# Altium schematic sheet jetson-nano.SchDoc
size A3; SheetNumber: 2; SheetTotal: 5
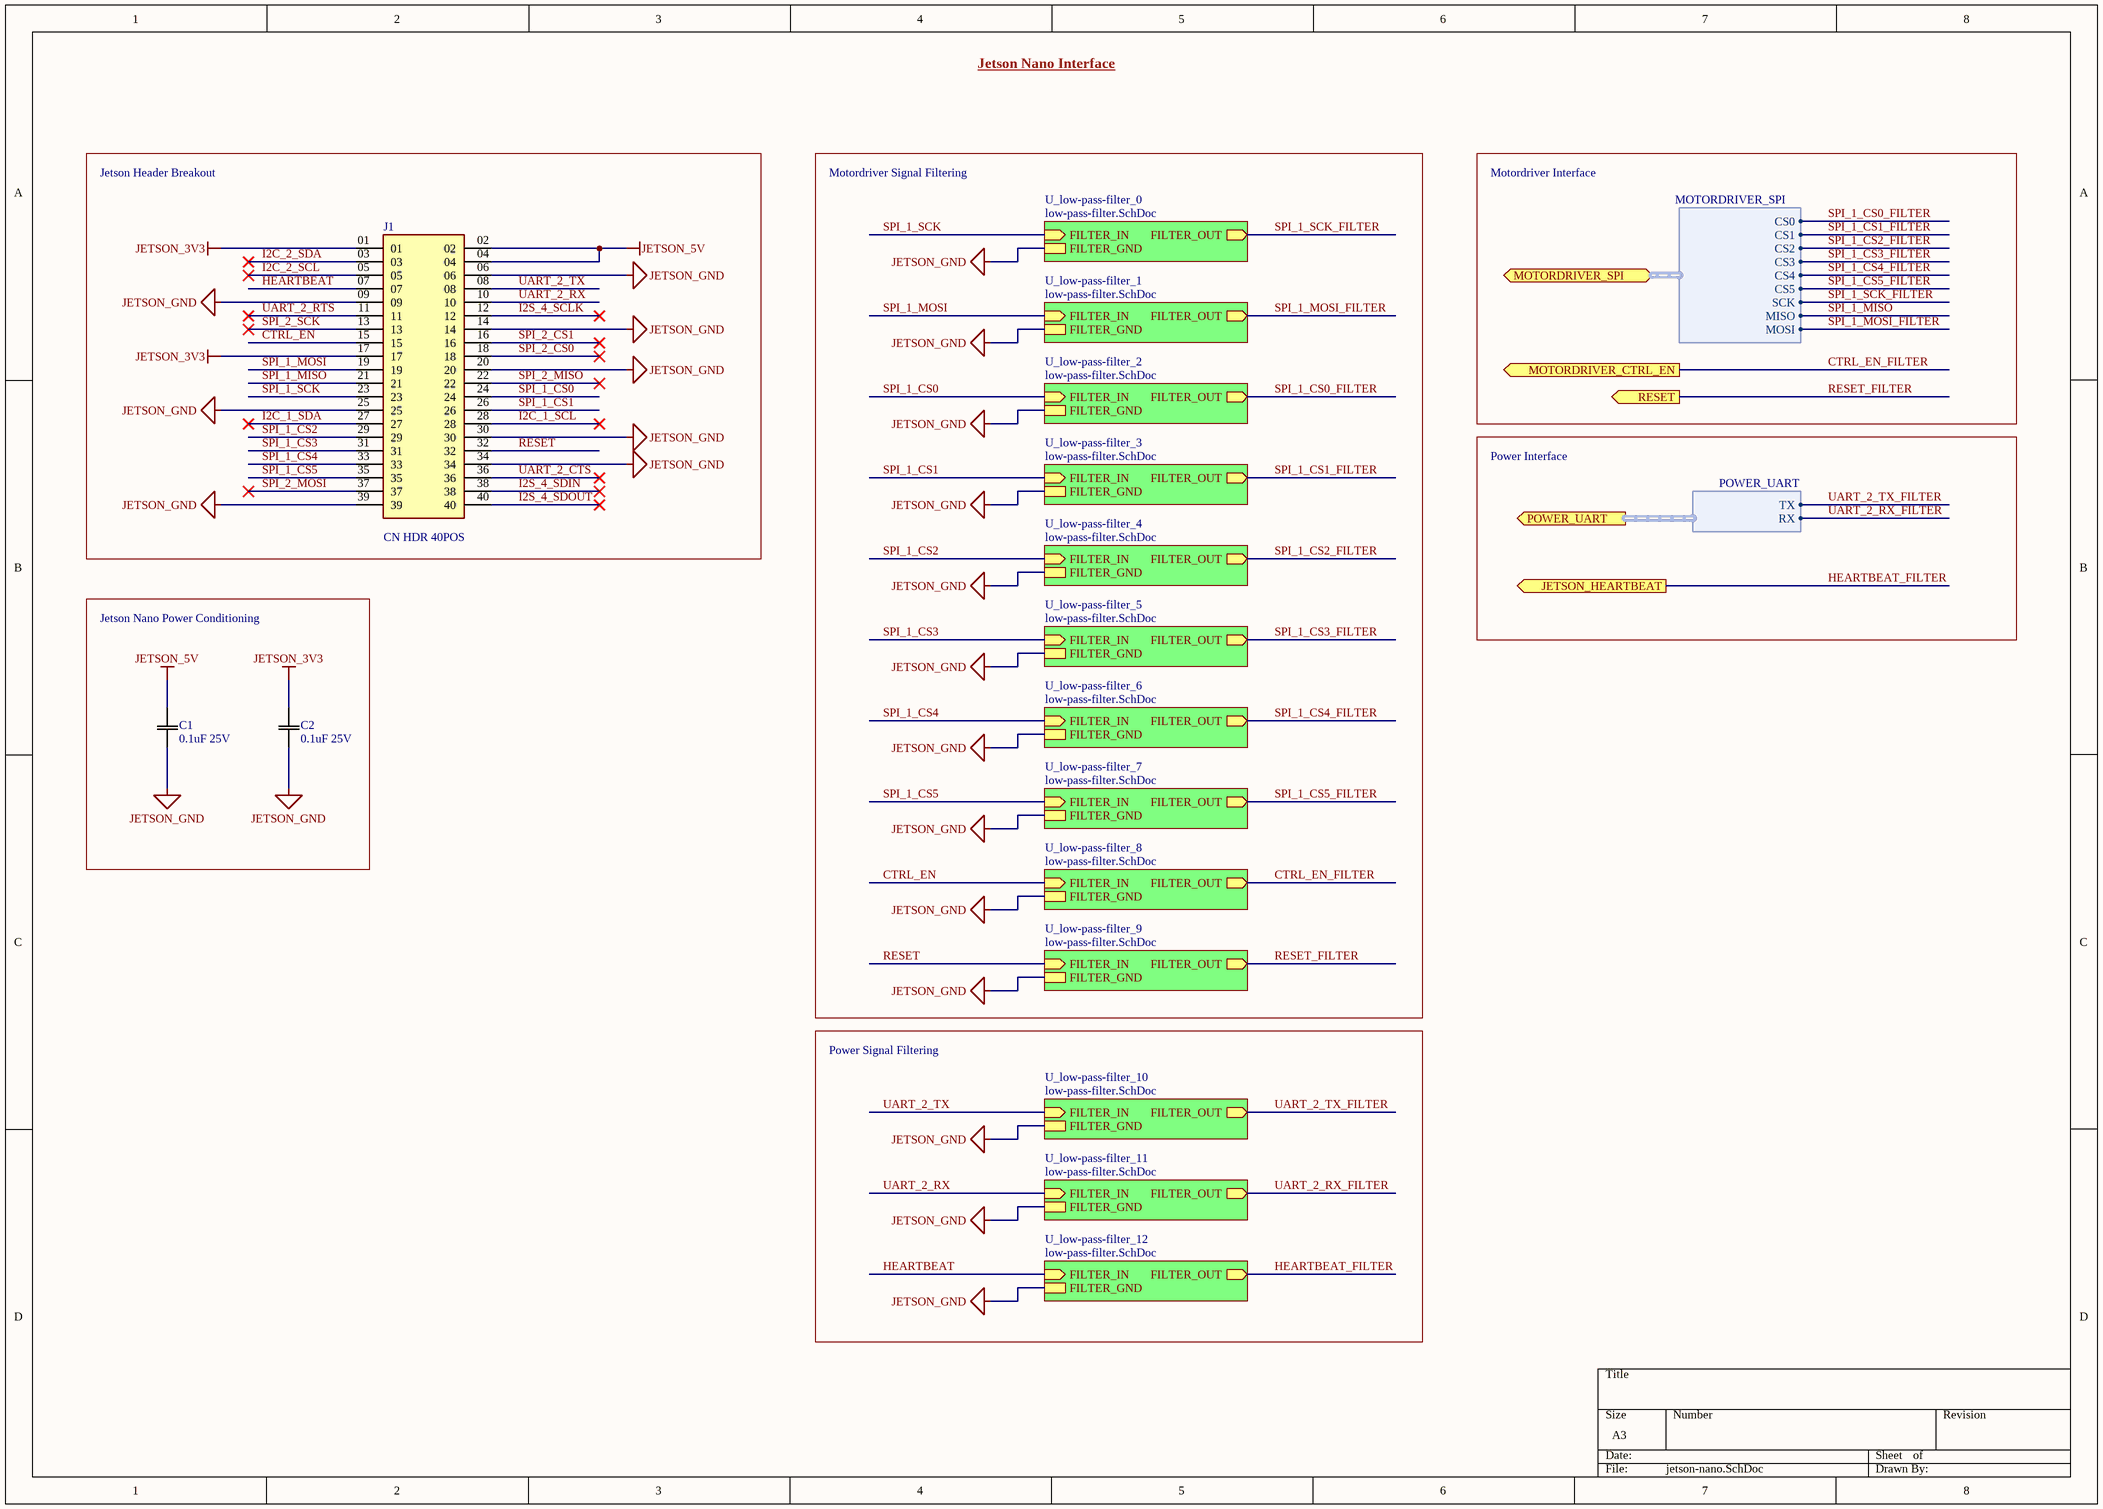
[diagram p0: jetson-nano.SchDoc]

## Parts
C1  0.1uF 25V  [0805]
C2  0.1uF 25V  [0805]
J1  CN HDR 40POS  [CN HDR 40POS 0.1 TH]

## Blocks framed on the sheet
Jetson Header Breakout: J1
Jetson Nano Power Conditioning: C1 C2

## Sub-sheets
U_low-pass-filter_0 = low-pass-filter.SchDoc: FILTER_OUT (out), FILTER_IN (in), FILTER_GND
U_low-pass-filter_1 = low-pass-filter.SchDoc: FILTER_OUT (out), FILTER_IN (in), FILTER_GND
U_low-pass-filter_2 = low-pass-filter.SchDoc: FILTER_OUT (out), FILTER_IN (in), FILTER_GND
U_low-pass-filter_3 = low-pass-filter.SchDoc: FILTER_OUT (out), FILTER_IN (in), FILTER_GND
U_low-pass-filter_4 = low-pass-filter.SchDoc: FILTER_OUT (out), FILTER_IN (in), FILTER_GND
U_low-pass-filter_5 = low-pass-filter.SchDoc: FILTER_OUT (out), FILTER_IN (in), FILTER_GND
U_low-pass-filter_6 = low-pass-filter.SchDoc: FILTER_OUT (out), FILTER_IN (in), FILTER_GND
U_low-pass-filter_7 = low-pass-filter.SchDoc: FILTER_OUT (out), FILTER_IN (in), FILTER_GND
U_low-pass-filter_8 = low-pass-filter.SchDoc: FILTER_OUT (out), FILTER_IN (in), FILTER_GND
U_low-pass-filter_9 = low-pass-filter.SchDoc: FILTER_OUT (out), FILTER_IN (in), FILTER_GND
U_low-pass-filter_10 = low-pass-filter.SchDoc: FILTER_OUT (out), FILTER_IN (in), FILTER_GND
U_low-pass-filter_11 = low-pass-filter.SchDoc: FILTER_OUT (out), FILTER_IN (in), FILTER_GND
U_low-pass-filter_12 = low-pass-filter.SchDoc: FILTER_OUT (out), FILTER_IN (in), FILTER_GND

## Ports
JETSON_HEARTBEAT (out), MOTORDRIVER_CTRL_EN (out), MOTORDRIVER_SPI (bidir, harness MOTORDRIVER_SPI), POWER_UART (out, harness POWER_UART), RESET (out)

## Harnesses
POWER_UART: TX, RX
MOTORDRIVER_SPI: CS0, CS1, CS2, CS3, CS4, CS5, SCK, MISO, MOSI

## Nets
JETSON_3V3: C2.2(C2) J1.01 J1.17
JETSON_5V: C1.2(C2) J1.02 J1.04
JETSON_GND: C1.1(C1) C2.1(C1) J1.06 J1.09 J1.14 J1.20 J1.25 J1.30 J1.34 J1.39 ; sheet U_low-pass-filter_7/FILTER_GND, sheet U_low-pass-filter_0/FILTER_GND, sheet U_low-pass-filter_1/FILTER_GND, sheet U_low-pass-filter_2/FILTER_GND, sheet U_low-pass-filter_3/FILTER_GND, sheet U_low-pass-filter_4/FILTER_GND, sheet U_low-pass-filter_5/FILTER_GND, sheet U_low-pass-filter_6/FILTER_GND, sheet U_low-pass-filter_10/FILTER_GND, sheet U_low-pass-filter_11/FILTER_GND, sheet U_low-pass-filter_12/FILTER_GND, sheet U_low-pass-filter_8/FILTER_GND, sheet U_low-pass-filter_9/FILTER_GND
CTRL_EN: J1.15 ; sheet U_low-pass-filter_8/FILTER_IN
CTRL_EN_FILTER: port MOTORDRIVER_CTRL_EN, sheet U_low-pass-filter_8/FILTER_OUT
HEARTBEAT: J1.07 ; sheet U_low-pass-filter_12/FILTER_IN
HEARTBEAT_FILTER: port JETSON_HEARTBEAT, sheet U_low-pass-filter_12/FILTER_OUT
I2C_1_SCL: J1.28
I2C_1_SDA: J1.27
I2C_2_SCL: J1.05
I2C_2_SDA: J1.03
I2S_4_SCLK: J1.12
I2S_4_SDIN: J1.38
I2S_4_SDOUT: J1.40
RESET: J1.32 ; sheet U_low-pass-filter_9/FILTER_IN
RESET_FILTER: port RESET, sheet U_low-pass-filter_9/FILTER_OUT
SPI_1_CS0: J1.24 ; sheet U_low-pass-filter_2/FILTER_IN
SPI_1_CS0_FILTER: sheet U_low-pass-filter_2/FILTER_OUT, port MOTORDRIVER_SPI.CS0
SPI_1_CS1: J1.26 ; sheet U_low-pass-filter_3/FILTER_IN
SPI_1_CS1_FILTER: sheet U_low-pass-filter_3/FILTER_OUT, port MOTORDRIVER_SPI.CS1
SPI_1_CS2: J1.29 ; sheet U_low-pass-filter_4/FILTER_IN
SPI_1_CS2_FILTER: sheet U_low-pass-filter_4/FILTER_OUT, port MOTORDRIVER_SPI.CS2
SPI_1_CS3: J1.31 ; sheet U_low-pass-filter_5/FILTER_IN
SPI_1_CS3_FILTER: sheet U_low-pass-filter_5/FILTER_OUT, port MOTORDRIVER_SPI.CS3
SPI_1_CS4: J1.33 ; sheet U_low-pass-filter_6/FILTER_IN
SPI_1_CS4_FILTER: sheet U_low-pass-filter_6/FILTER_OUT, port MOTORDRIVER_SPI.CS4
SPI_1_CS5: J1.35 ; sheet U_low-pass-filter_7/FILTER_IN
SPI_1_CS5_FILTER: sheet U_low-pass-filter_7/FILTER_OUT, port MOTORDRIVER_SPI.CS5
SPI_1_MISO: J1.21 ; port MOTORDRIVER_SPI.MISO
SPI_1_MOSI: J1.19 ; sheet U_low-pass-filter_1/FILTER_IN
SPI_1_MOSI_FILTER: sheet U_low-pass-filter_1/FILTER_OUT, port MOTORDRIVER_SPI.MOSI
SPI_1_SCK: J1.23 ; sheet U_low-pass-filter_0/FILTER_IN
SPI_1_SCK_FILTER: sheet U_low-pass-filter_0/FILTER_OUT, port MOTORDRIVER_SPI.SCK
SPI_2_CS0: J1.18
SPI_2_CS1: J1.16
SPI_2_MISO: J1.22
SPI_2_MOSI: J1.37
SPI_2_SCK: J1.13
UART_2_CTS: J1.36
UART_2_RTS: J1.11
UART_2_RX: J1.10 ; sheet U_low-pass-filter_11/FILTER_IN
UART_2_RX_FILTER: sheet U_low-pass-filter_11/FILTER_OUT, port POWER_UART.RX
UART_2_TX: J1.08 ; sheet U_low-pass-filter_10/FILTER_IN
UART_2_TX_FILTER: sheet U_low-pass-filter_10/FILTER_OUT, port POWER_UART.TX

## Notes on the sheet
- Jetson Nano Interface
- Motordriver Signal Filtering
- Motordriver Interface
- Power Interface
- Power Signal Filtering

## Library data of the parts
C1 C2 = CAP 0.1uF 25V: Default Symbol for Capacitors; Temperature Coefficient: X7R; Tolerance: 10%; Value: 0.1uF; Rating: 25V; Operating Temperature: -55°C ~ 125°C; Part Number: CAP 0.1uF 25V
J1 = CN HDR 40POS: 40 Position Header Connector; Part Number: CN HDR 40POS; Supplier 1: Digi-Key; Supplier Part Number 1: S6104-ND; Pin Count: 40; Supplier URL 1: https://www.digikey.ca/en/products/detail/sullins-connector-solutions/PPTC202LFBN-RC/807240?s=N4IgTCBcDaIMoDYCMAGALAWgHIBEQF0BfIA